# Altium project smarchWand.PrjPcb
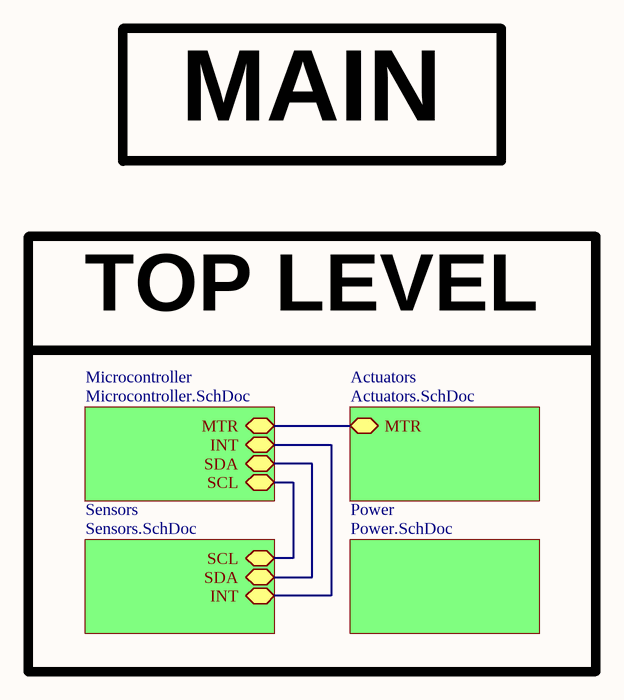
[diagram p0: Main.SchDoc]
5 sheets, 39 parts. Net scope: hierarchical (ports join the sheet entries above them; power ports are global).
Sheets:
  Main.SchDoc
    Actuators = Actuators.SchDoc
    Microcontroller = Microcontroller.SchDoc
    Power = Power.SchDoc
    Sensors = Sensors.SchDoc

## Sheet Main.SchDoc
size A; DocumentNumber: 1; SheetNumber: 1; SheetTotal: 5

### Sub-sheets
Actuators = Actuators.SchDoc: MTR
Microcontroller = Microcontroller.SchDoc: MTR, INT, SDA, SCL
Power = Power.SchDoc: no entries
Sensors = Sensors.SchDoc: INT, SDA, SCL

### Nets
INT: sheet Microcontroller/INT, sheet Sensors/INT
MTR: sheet Actuators/MTR, sheet Microcontroller/MTR
SCL: sheet Microcontroller/SCL, sheet Sensors/SCL
SDA: sheet Microcontroller/SDA, sheet Sensors/SDA

### Notes on the sheet
- MAIN
- TOP LEVEL

## Sheet Actuators.SchDoc
size A; DocumentNumber: 4; SheetNumber: 4; SheetTotal: 5
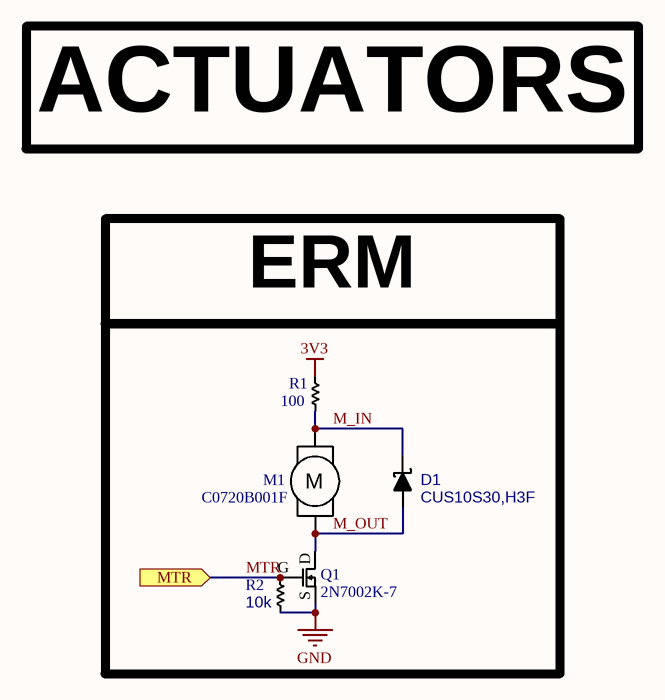
[diagram p1: Actuators.SchDoc]

### Parts
D1  CUS10S30,H3F  [CUS10S30,H3F]
M1  C0720B001F  [C0720B001F]
Q1  2N7002K-7  [2N7002K-7]
R1  100  [RES_0805_HIGH]
R2  10k  [RES_0402_HIGH]

### Ports
MTR (in)

### Nets
3V3: R1.2
GND: Q1.S R2.1
M_IN: D1.1 M1.2 R1.1
M_OUT: D1.2 M1.1 Q1.D
MTR: Q1.G R2.2 ; port MTR

### Notes on the sheet
- ACTUATORS
- (near R1) ERM
- (in symbol C0720B001F) M

### Library data of the parts
D1 = CUS10S30,H3F: CUS10S30,H3F Diode Schottky 30V 1A Surface Mount USC
M1 = C0720B001F: C0720B001F DC Motor Vibration, ERM 10000 RPM   3VDC
Q1 = 2N7002K-7: 2N7002K-7 MOSFET N-CH 60V 380MA SOT23-3
R1 = Resistor_0805: 0805 Resistor
R2 = Resistor_0402: 0402 Resistor

## Sheet Microcontroller.SchDoc
size A; DocumentNumber: 2; SheetNumber: 2; SheetTotal: 5
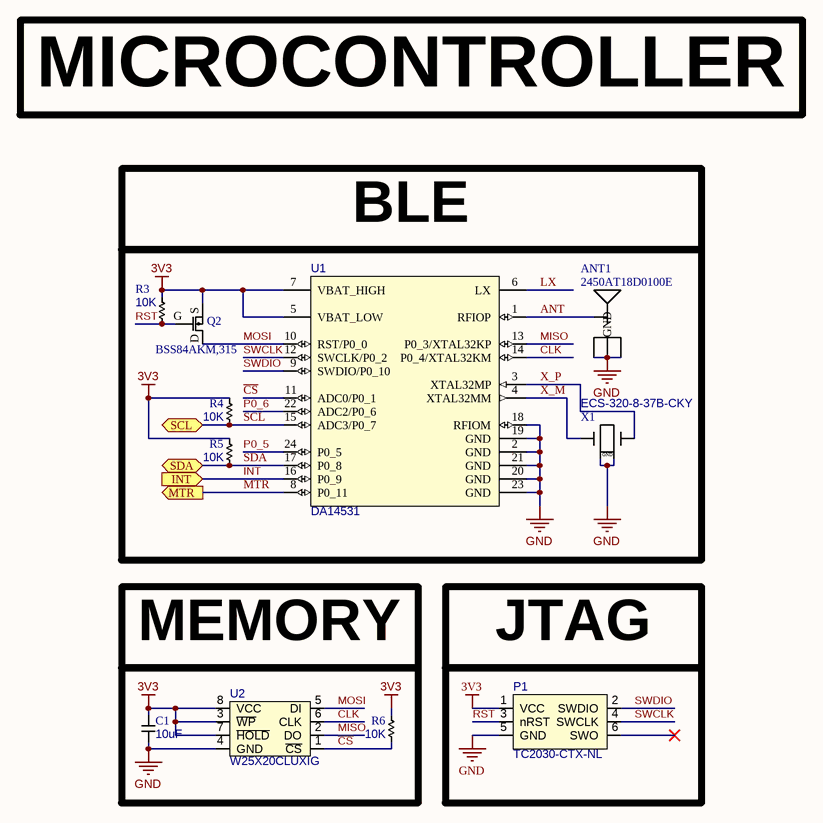
[diagram p2: Microcontroller.SchDoc]

### Parts
ANT1  2450AT18D0100E  [2450AT18D0100E_RH]
C1  10uF  [CAP_0402_HIGH]
P1  TC2030-CTX-NL  [TC2030-CTX-NL]
Q2  BSS84AKM,315  [BSS84AKM,315]
R3  10K  [RES_0402_HIGH]
R4  10K  [RES_0402_HIGH]
R5  10K  [RES_0402_HIGH]
R6  10K  [RES_0402_HIGH]
U1  DA14531  [DA14531 QFN]
U2  W25X20CLUXIG  [W25X20CLUXIG]
X1  ECS-320-8-37B-CKY  [ECS-320-8-37B-CKY]

### Ports
INT, MTR (out), SCL (bidir), SDA (bidir)

### Nets
3V3: C1.2 P1.1(VCC) Q2.S R3.2 R4.2 R5.2 R6.2 U1.5(VBAT_LOW) U1.7(VBAT_HIGH) U2.3(~{WP}) U2.7(~{HOLD}) U2.8(VCC)
GND: ANT1.2(GND) ANT1.3(GND) ANT1.4(GND) C1.1 P1.5(GND) U1.2(GND) U1.18(RFIOM) U1.19(GND) U1.20(GND) U1.21(GND) U1.23(GND) U2.4(GND) X1.2 X1.4(GND)
ANT: ANT1.1(FEED) U1.1(RFIOP)
~{CS}: R6.1 U1.11(ADC0/P0_1) U2.1(~{CS})
CLK: U1.14(P0_4/XTAL32KM) U2.6(CLK)
INT: U1.16(P0_9) ; port INT
LX: U1.6(LX)
MISO: U1.13(P0_3/XTAL32KP) U2.2(DO)
MOSI: Q2.D U1.10(RST/P0_0) U2.5(DI)
MTR: U1.8(P0_11) ; port MTR
P0_5: U1.24(P0_5)
P0_6: U1.22(ADC2/P0_6)
RST: P1.3(nRST) Q2.G R3.1
SCL: R4.1 U1.15(ADC3/P0_7) ; port SCL
SDA: R5.1 U1.17(P0_8) ; port SDA
SWCLK: P1.4(SWCLK) U1.12(SWCLK/P0_2)
SWDIO: P1.2(SWDIO) U1.9(SWDIO/P0_10)
X_M: U1.4(XTAL32MM) X1.1
X_P: U1.3(XTAL32MP) X1.3

Not connected (* = marked no-connect by the designer): P1 6(SWO)*

### Notes on the sheet
- MICROCONTROLLER
- BLE
- MEMORY
- (near P1) JTAG

### Library data of the parts
ANT1 = 2450AT18D0100E_RH: 2450AT18D0100E 2.4GHz  Chip RF Antenna 2.4GHz ~ 2.5GHz 1.5dBi Solder Surface Mount
C1 = Capacitor_0402: 0402 Capacitor
P1 = TC2030-CTX-NL: TC2030-CTX-NL Tag Connect Cable; ComponentLink1Description: Datasheet; ComponentLink1URL: https://www.tag-connect.com/wp-content/uploads/bsk-pdf-manager/TC2030-CTX_1.pdf
Q2 = BSS84AKM,315: BSS84AKM,315 MOSFET P-CH 50V SOT883
R3-R6 = Resistor_0402: 0402 Resistor
U1 = DA14531 QFN: DA14531 IC RF TxRx + MCU Bluetooth Bluetooth v5.1 2.4GHz 24-WFQFN, FC
U2 = W25X20CLUXIG: W25X20CLUXIG FLASH Memory IC 2Mb (256K x 8) SPI 104MHz  8-USON (2x3)
X1 = ECS-320-8-37B-CKY: ECS-320-8-37B-CKY CRYSTAL 32.0000MHZ 8PF SMD

## Sheet Power.SchDoc
size A; DocumentNumber: 5; SheetNumber: 5; SheetTotal: 5
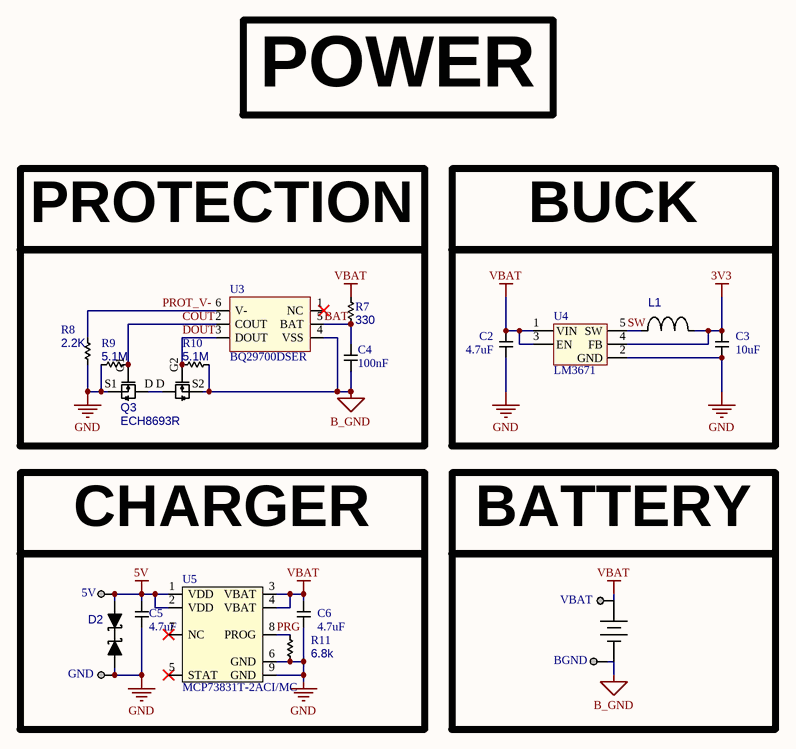
[diagram p3: Power.SchDoc]

### Parts
5V  0.1" Header  [0.1" Header]  (value not drawn)  (no BOM)
BGND  0.1" Header  [0.1" Header]  (value not drawn)  (no BOM)
C2  4.7uF  [CAP_0402_HIGH]
C3  10uF  [CAP_0402_HIGH]
C4  100nF  [CAP_0402_HIGH]
C5  4.7uF  [CAP_0402_HIGH]
C6  4.7uF  [CAP_0402_HIGH]
D2  D5V0L1B2LP4-7B  [D5V0L1B2LP4-7B]  (value not drawn)
GND  0.1" Header  [0.1" Header]  (value not drawn)  (no BOM)
L1  CIGT201610EH2R2MNE  [CIGT201610EH2R2MNE]  (value not drawn)
Q3  ECH8693R  [ECH8693R]
R7  330  [RES_0402_HIGH]
R8  2.2K  [RES_0402_HIGH]
R9  5.1M  [RES_0402_HIGH]
R10  5.1M  [RES_0402_HIGH]
R11  6.8k  [RES_0402_HIGH]
U3  BQ29700DSER  [BQ29700DSER]
U4  LM3671  [LM3671-BGA]
U5  MCP73831T-2ACI/MC  [MCP73831T-2ACI/MC]
VBAT  0.1" Header  [0.1" Header]  (value not drawn)  (no BOM)

### Nets
3V3: C3.2 L1.2 U4.4(FB)
5V: 5V.1 C5.2 D2.1 U5.1(VDD) U5.2(VDD)
B_GND: BGND.1 C4.1 Q3.S2(S) R10.1 U3.4(VSS)
GND: C2.1 C3.1 C5.1 C6.1 D2.2 GND.1 Q3.S1(S) R8.1 R9.2 R11.2 U4.2(GND) U5.6(GND) U5.9(GND)
VBAT: C2.2 C6.2 R7.1 U4.1(VIN) U4.3(EN) U5.3(VBAT) U5.4(VBAT) VBAT.1
BAT: C4.2 R7.2 U3.5(BAT)
COUT: Q3.G1(G) R9.1 U3.2(COUT)
DOUT: Q3.G2(G) R10.2 U3.3(DOUT)
PRG: R11.1 U5.8(PROG)
PROT_V-: R8.2 U3.6(V-)
SW: L1.1 U4.5(SW)

Not connected (* = marked no-connect by the designer): Q3 D; U3 1(NC)*; U5 5(STAT)* 7(NC)*

### Notes on the sheet
- POWER
- PROTECTION
- BUCK
- CHARGER
- (near VBAT) BATTERY

### Library data of the parts
C2-C6 = Capacitor_0402: 0402 Capacitor
D2 = D5V0L1B2LP4-7B: D5V0L1B2LP4-7B 14V Clamp 6A (8/20µs) Ipp Tvs Diode Surface Mount X2-DFN1006-2
L1 = CIGT201610EH2R2MNE: CIGT201610EH2R2MNE 2.2µH Unshielded Thin Film Inductor 2.5A 87mOhm Max 0806 (2016 Metric)
Q3 = ECH8693R: Mosfet Array 2 N-Channel (Dual) Common Drain 24V 14A 1.4W Surface Mount SOT-28FL/ECH8
R7-R11 = Resistor_0402: 0402 Resistor
U3 = BQ29700DSER: Battery Battery Protection IC Lithium-Ion/Polymer 6-WSON (1.5x1.5)
U4 = LM3671: LM3671 IC REG BUCK 3.3V 0.6A SYNC 5USMD
U5 = MCP73831T-2ACI/MC: MCP73831T-2ACI/MC Charger IC Lithium-Ion/Polymer

## Sheet Sensors.SchDoc
size A; DocumentNumber: 3; SheetNumber: 3; SheetTotal: 5
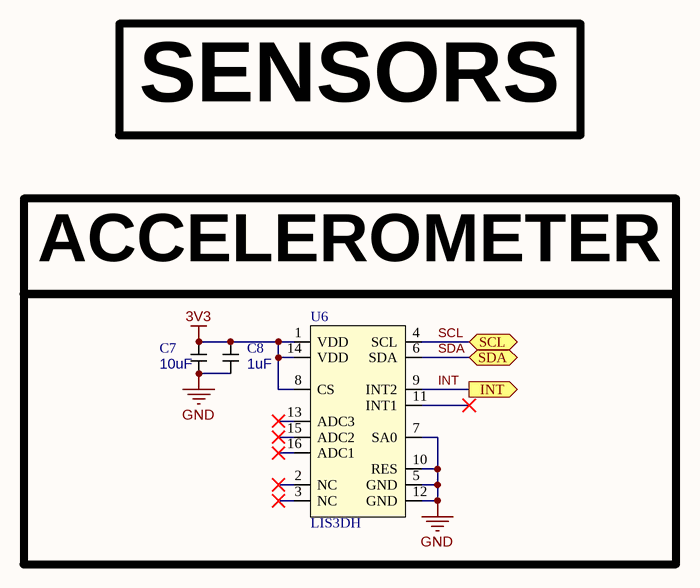
[diagram p4: Sensors.SchDoc]

### Parts
C7  10uF  [CAP_0402_HIGH]
C8  1uF  [CAP_0402_HIGH]
U6  LIS3DH  [LIS3DH]

### Ports
INT (out), SCL (bidir), SDA (bidir)

### Nets
3V3: C7.2 C8.2 U6.1(VDD) U6.8(CS) U6.14(VDD)
GND: C7.1 C8.1 U6.5(GND) U6.7(SA0) U6.10(RES) U6.12(GND)
INT: U6.9(INT2) ; port INT
SCL: U6.4(SCL) ; port SCL
SDA: U6.6(SDA) ; port SDA

Not connected (* = marked no-connect by the designer): U6 2(NC)* 3(NC)* 11(INT1)* 13(ADC3)* 15(ADC2)* 16(ADC1)*

### Notes on the sheet
- SENSORS
- ACCELEROMETER

### Library data of the parts
C7 C8 = Capacitor_0402: 0402 Capacitor
U6 = LIS3DH: LIS3DH ACCEL 2-16G I2C/SPI 16LGA

## Nets that join several sheets
3V3: Actuators (R1.2), Microcontroller (12 pins), Power (C3.2 L1.2 U4.4), Sensors (5 pins)
GND: Actuators (Q1.S R2.1), Microcontroller (14 pins), Power (13 pins), Sensors (6 pins)
INT: Microcontroller (U1.16), Sensors (U6.9)
MTR: Actuators (Q1.G R2.2), Microcontroller (U1.8)
SCL: Microcontroller (R4.1 U1.15), Sensors (U6.4)
SDA: Microcontroller (R5.1 U1.17), Sensors (U6.6)